# Altium schematic sheet COMMUNICATION.SchDoc
size 420 x 297 mm; SheetNumber: 4; SheetTotal: 5
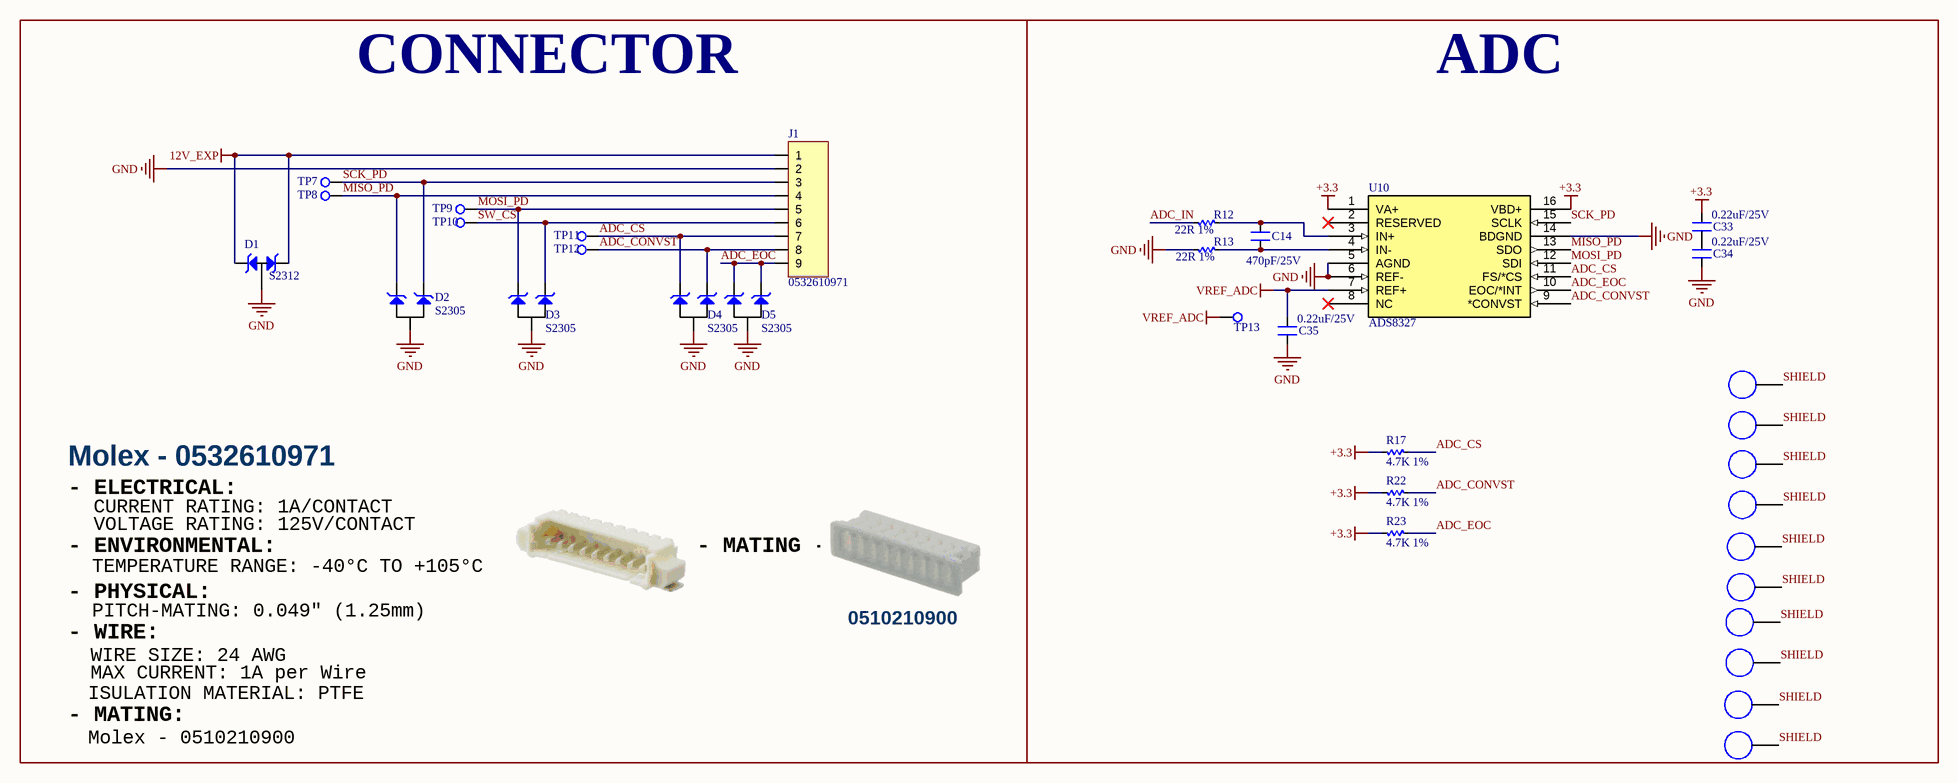
[diagram p0: COMMUNICATION.SchDoc]

## Parts
C14  470pF/25V  [CN-SMD-0603]
C33  0.22uF/25V  [CN-SMD-0603]
C34  0.22uF/25V  [CN-SMD-0603]
C35  0.22uF/25V  [CN-SMD-0603]
D1  S2312  [SOT23-123]
D2  S2305  [SOT23-123]
D3  S2305  [SOT23-123]
D4  S2305  [SOT23-123]
D5  S2305  [SOT23-123]
H1  HOLD  [M3 - 6mm]  (value not drawn)
H2  HOLD  [M3 - 6mm]  (value not drawn)
H3  HOLD  [M3 - 6mm]  (value not drawn)
H4  HOLD  [M3 - 6mm]  (value not drawn)
H5  HOLD  [M3 - 6mm]  (value not drawn)
H6  HOLD  [M3 - 6mm]  (value not drawn)
H7  HOLD  [M3 - 6mm]  (value not drawn)
H8  HOLD  [M3 - 6mm]  (value not drawn)
H9  HOLD  [M3 - 6mm]  (value not drawn)
H10  HOLD  [M3 - 6mm]  (value not drawn)
J1  0532610971  [0532610971]
R12  22R 1%  [RES-SMD-0603]
R13  22R 1%  [RES-SMD-0603]
R17  4.7K 1%  [RES-SMD-0603]
R22  4.7K 1%  [RES-SMD-0603]
R23  4.7K 1%  [RES-SMD-0603]
TP7  Test_Point  [TESTPOINT]  (value not drawn)
TP8  Test_Point  [TESTPOINT]  (value not drawn)
TP9  Test_Point  [TESTPOINT]  (value not drawn)
TP10  Test_Point  [TESTPOINT]  (value not drawn)
TP11  Test_Point  [TESTPOINT]  (value not drawn)
TP12  Test_Point  [TESTPOINT]  (value not drawn)
TP13  Test_Point  [TESTPOINT]  (value not drawn)
U10  ADS8327  [TSSOP16]

## Blocks framed on the sheet
CONNECTOR: D1-D5 J1 TP7-TP12
ADC: C14 C33-C35 H1-H10 R12 R13 R17 R22 R23 TP13 U10

## Nets
12V_EXP: D1.1 D1.3 J1.1
+3.3: C33.2 R17.2 R22.2 R23.2 U10.1(VA+) U10.16(VBD+)
GND: C34.1 C35.1 D1.2 D2.2 D3.2 D4.2 D5.2 J1.2 R13.2 U10.5(AGND) U10.6(REF-) U10.14(BDGND)
VREF_ADC: C35.2 TP13.1 U10.7(REF+)
ADC_CONVST: D4.3 J1.8 R22.1 TP12.1 U10.9(*CONVST)
ADC_CS: D4.1 J1.7 R17.1 TP11.1 U10.11(FS/*CS)
ADC_EOC: D5.1 D5.3 J1.9 R23.1 U10.10(EOC/*INT)
ADC_IN: R12.2
MISO_PD: D2.3 J1.4 TP8.1 U10.13(SDO)
MOSI_PD: D3.1 J1.5 TP9.1 U10.12(SDI)
SCK_PD: D2.1 J1.3 TP7.1 U10.15(SCLK)
SHIELD: H1.1 H2.1 H3.1 H4.1 H5.1 H6.1 H7.1 H8.1 H9.1 H10.1
SW_CS: D3.3 J1.6 TP10.1
NetC14_1: C14.1 R13.1 U10.4(IN-)
NetC14_2: C14.2 R12.1 U10.3(IN+)
NetC33_1: C33.1 C34.2

Not connected (* = marked no-connect by the designer): U10 2(RESERVED)* 8(NC)*

## Notes on the sheet
- Molex - 0532610971
- - ELECTRICAL:
- - ENVIRONMENTAL:
- CURRENT RATING: 1A/CONTACT
- VOLTAGE RATING: 125V/CONTACT
- - MATING -
- - PHYSICAL:
- TEMPERATURE RANGE: -40°C TO +105°C
- PITCH-MATING: 0.049" (1.25mm)
- 0510210900
- - WIRE:
- WIRE SIZE: 24 AWG
- MAX CURRENT: 1A per Wire
- - MATING:
- ISULATION MATERIAL: PTFE
- Molex - 0510210900
- Project:
- BEE-PC1
- Sub-system:
- Design by:
- Hung Nguyen D.
- Bao Bui Q.
- Sheet title:
- Sheet
- A3
- of
- Checked by:
- Approved by:
- Vu Pham
- Revision:
- Document No:
- V1.2.0
- Size:
- Date:

## Library data of the parts
C14 C33-C35 = CM: 0603; Value: 103
D1 = S2315: TVS DIODE 12VWM 19VC SOT23, P/N:  S2312
D2-D5 = S2303: TVS DIODE 5VWM 10.8VC SOT23, P/N: / S2305
H1-H10 = PAD_HOLD
J1 = JP9: WR-PHD 2.54 mm Angled Socket Header; Manufacturer: W¨¹rth Elektronik eiSos GmbH; partNo: 613009143121; ComponentLink1 Description: Manufacturer; ComponentLink2 Description: Datasheet; NoPins: 09; Created Date: 29 March 2013; ComponentLink1URL: http://www.we-online.com; ComponentLink2URL: http://katalog.we-online.de/em/datasheet/6130xx143121.pdf; Created by: Karrer Zheng
R12 R13 R17 R22 R23 = Res-SMD: 0603; Manufacturer: Generic Components; Class: Passive; Published: 08/06/2000; Publisher: Altium Hobart Technology Centre
U10 = ADS8327: IC ADC 16BIT SAR 16TSSOP; Supplier 1: Mouser; Supplier Part Number 1: 595-ADS8327IPW